# Altium schematic sheet Flash.SchDoc
size 420 x 297 mm
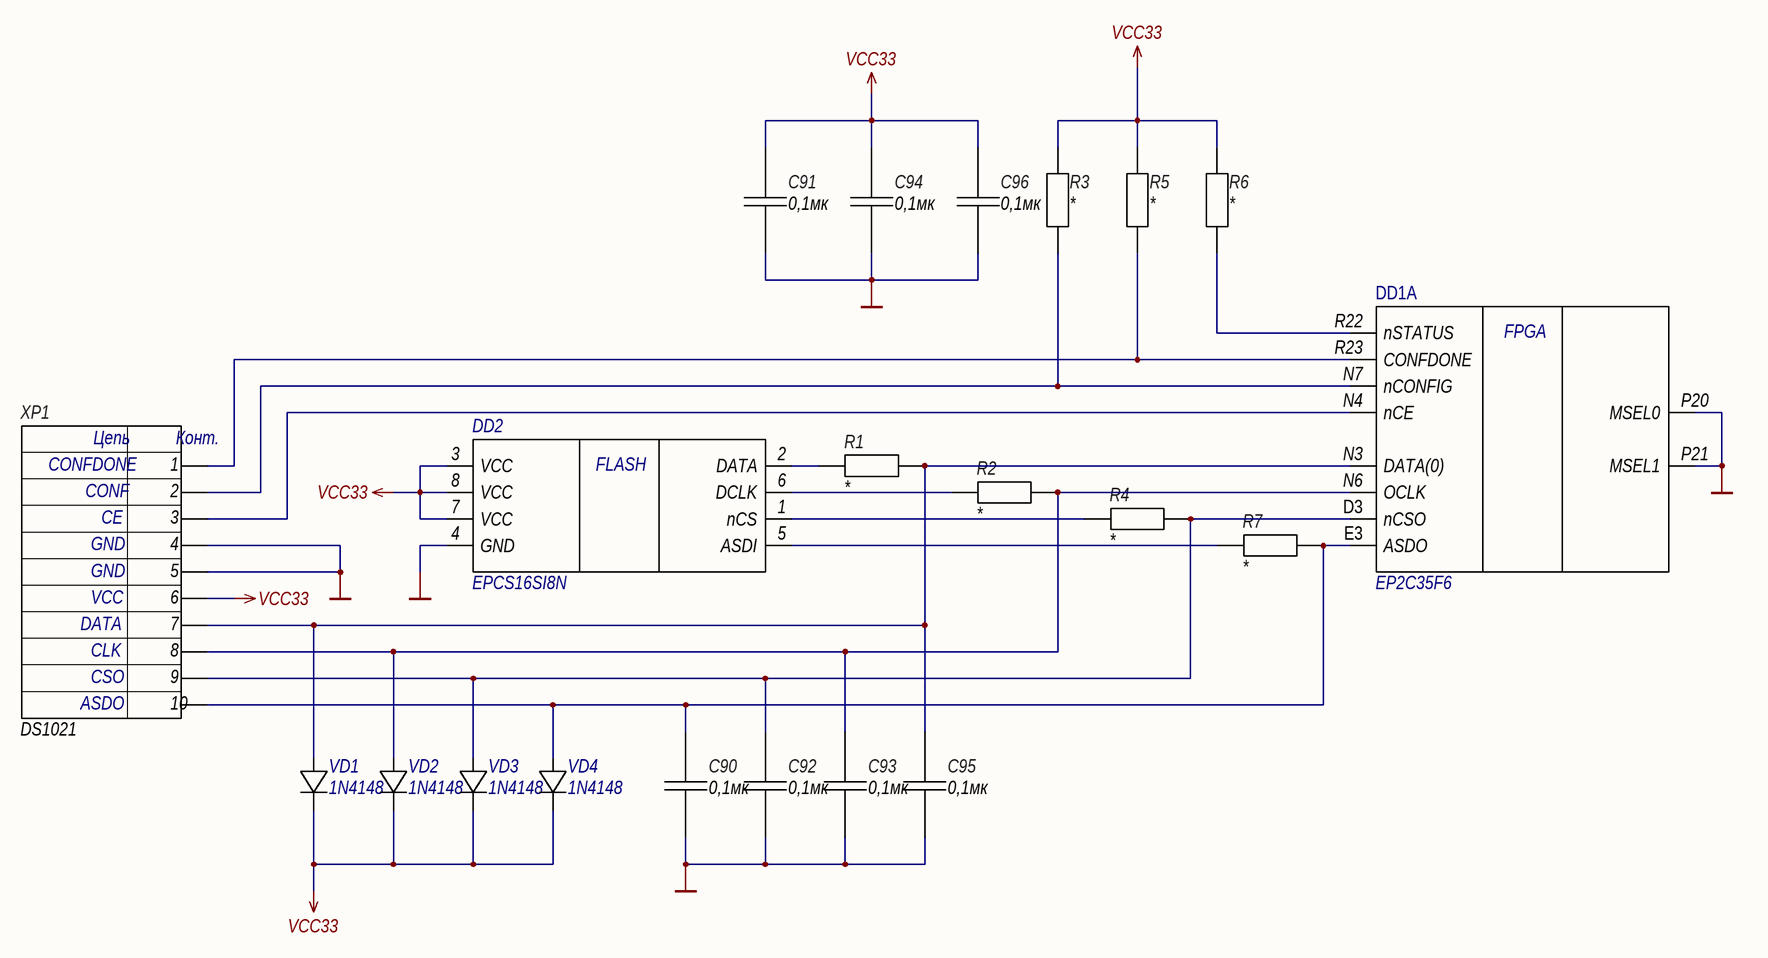
[diagram p0: Flash.SchDoc]

## Parts
C90  0,1мк  [0603]
C91  0,1мк  [RESC1005X35N]
C92  0,1мк  [0603]
C93  0,1мк  [0603]
C94  0,1мк  [RESC1005X35N]
C95  0,1мк  [0603]
C96  0,1мк  [RESC1005X35N]
DD1  EP2C35F6  [BGA672CP100_26X26_2700X2700X240B60N]  (part A of 23)
DD2  EPCS16SI8N  [SOIC127P600X175-8N]
R1  *  [RESC3216X75N]
R2  *  [RESC3216X75N]
R3  *  [RESC3216X75N]
R4  *  [RESC3216X75N]
R5  *  [RESC3216X75N]
R6  *  [RESC3216X75N]
R7  *  [RESC3216X75N]
VD1  1N4148  [1N4148WVGS08]
VD2  1N4148  [1N4148WVGS08]
VD3  1N4148  [1N4148WVGS08]
VD4  1N4148  [1N4148WVGS08]
XP1  DS1021  [PBS-10]

## Nets
GND: C90.2 C91.2 C92.2 C93.2 C94.2 C95.2 C96.2 DD1.P20(MSEL0) DD1.P21(MSEL1) DD2.4(GND) XP1.4 XP1.5
VCC33: C91.1 C94.1 C96.1 DD2.3(VCC) DD2.7(VCC) DD2.8(VCC) R3.2 R5.2 R6.2 VD1.1 VD2.1 VD3.1 VD4.1 XP1.6
NetC90_1: C90.1 DD1.E3(ASDO) R7.2 VD4.2 XP1.10
NetC92_1: C92.1 DD1.D3(nCSO) R4.2 VD3.2 XP1.9
NetC93_1: C93.1 DD1.N6(OCLK) R2.2 VD2.2 XP1.8
NetC95_1: C95.1 DD1.N3(DATA(0)) R1.2 VD1.2 XP1.7
NetDD1_N4: DD1.N4(nCE) XP1.3
NetDD1_N7: DD1.N7(nCONFIG) R3.1 XP1.2
NetDD1_R22: DD1.R22(nSTATUS) R6.1
NetDD1_R23: DD1.R23(CONFDONE) R5.1 XP1.1
NetDD2_1: DD2.1(nCS) R4.1
NetDD2_2: DD2.2(DATA) R1.1
NetDD2_5: DD2.5(ASDI) R7.1
NetDD2_6: DD2.6(DCLK) R2.1

## Notes on the sheet
- CONFDONE
- CONF
- GND
- CE
- DATA
- VCC
- ASDO
- CLK
- CSO
- Перв.примен.
- Справ.№
- Подп. и дата
- Инв.№ дубл.
- Взам.инв.№
- Подп.и дата
- Разраб.
- Изм.
- Лист
- № докум.
- Подп.
- Дата
- Лит.
- Масштаб
- Масса
- Т.контр.
- Пров.
- СХЕМА   ЭЛЕКТРИЧЕСКАЯ
- ПРИНЦИПИАЛЬНАЯ
- Листов
- Инв.№ подл.
- Утв.
- Н.контр.
- Нач.сект.
- Формат  A3
- (in symbol Header 10x1) Цепь; Конт.
- (in symbol PLIS, part A) FPGA

## Library data of the parts
C90 C92 C93 C95 = Capacitor_0603: ValueType: Конденсатор; Value: 0,1мк; Tolerance: *; URL: *; Temp: *; Case: *; ValueManufacturer: *; ValueManufacturerPartNumber: *; ValueDescription: *; Dielectric: *; ESR: *; Voltage: *
C91 C94 C96 = Capacitor_0.1u: ValueType: Конденсатор; Value: 0,1мк; Tolerance: *; URL: *; Temp: *; Case: *; ValueManufacturer: *; ValueManufacturerPartNumber: *; ValueDescription: *; Dielectric: *; ESR: *; Voltage: *
DD1 = PLIS
DD2 = FLASH
R1 R2 R4 R7 = Resistor: ValueManufacturer: Yageo; ValueManufacturerPartNumber: RC0603JR-07680RL; Tolerance: 5%; Temp: -55*C..+155*C; Power: 0,1 Вт; ValueType: Резистор; Value: *; URL: *; Case: 0603; ValueDescription: *
R3 R5 R6 = Resistor_1206_10k: ValueManufacturer: Yageo; ValueManufacturerPartNumber: RC0603JR-07680RL; Tolerance: 5%; Temp: -55*C..+155*C; Power: 0,1 Вт; ValueType: Резистор; Value: *; URL: *; Case: 0603; ValueDescription: *
VD1-VD4 = VD 1N41448
XP1 = Header 10x1: ValueType: Разъем; Case: PBS-10